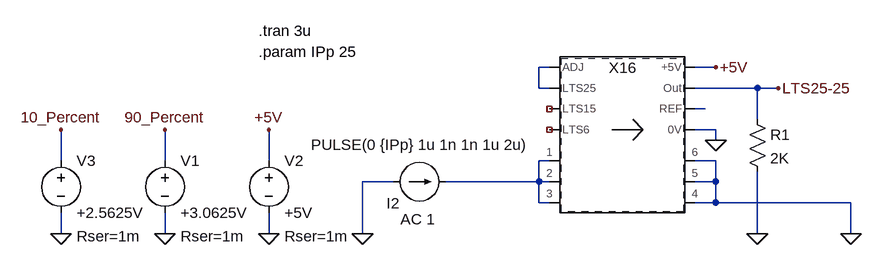
[diagram p0: schematic LTS-XX_hy_Test_Risetime.asc]
LTS-XX_hy_Test_Risetime.asc, the LTspice schematic file:
Version 4
SHEET 1 2536 1600
WIRE -384 336 -400 336
WIRE -128 336 -160 336
WIRE -400 368 -400 336
WIRE -384 368 -400 368
WIRE -64 368 -160 368
WIRE -32 368 -64 368
WIRE -144 400 -160 400
WIRE -64 416 -64 368
WIRE -128 432 -160 432
WIRE -128 448 -128 432
WIRE -1136 480 -1136 432
WIRE -976 480 -976 432
WIRE -816 480 -816 432
WIRE -384 480 -400 480
WIRE -128 480 -160 480
WIRE -624 512 -672 512
WIRE -400 512 -400 480
WIRE -400 512 -544 512
WIRE -384 512 -400 512
WIRE -128 512 -128 480
WIRE -128 512 -160 512
WIRE -400 544 -400 512
WIRE -384 544 -400 544
WIRE -128 544 -128 512
WIRE -128 544 -160 544
WIRE 80 544 -128 544
WIRE -1136 592 -1136 560
WIRE -976 592 -976 560
WIRE -816 592 -816 560
WIRE -672 592 -672 512
WIRE -64 592 -64 496
WIRE 80 592 80 544
FLAG -672 592 0
FLAG -128 448 0
FLAG -816 592 0
FLAG -816 432 +5V
FLAG -128 336 +5V
FLAG -32 368 LTS25-25
FLAG -64 592 0
FLAG 80 592 0
FLAG -976 592 0
FLAG -976 432 90_Percent
FLAG -1136 592 0
FLAG -1136 432 10_Percent
SYMBOL voltage -816 464 R0
WINDOW 123 0 0 Left 0
WINDOW 39 24 132 Left 0
SYMATTR SpiceLine Rser=1m
SYMATTR InstName V2
SYMATTR Value +5V
SYMBOL res -80 400 R0
SYMATTR InstName R1
SYMATTR Value 2K
SYMBOL current -624 512 M90
WINDOW 123 58 64 VLeft 0
WINDOW 39 0 0 Left 0
WINDOW 3 -57 209 VLeft 0
WINDOW 0 33 9 VLeft 0
SYMATTR Value2 AC 1
SYMATTR Value PULSE(0 {IPp} 1u 1n 1n 1u 2u)
SYMATTR InstName I2
SYMBOL LTS-XX_hy -272 448 R0
SYMATTR InstName X16
SYMBOL voltage -976 464 R0
WINDOW 123 0 0 Left 0
WINDOW 39 24 132 Left 0
SYMATTR SpiceLine Rser=1m
SYMATTR InstName V1
SYMATTR Value +3.0625V
SYMBOL voltage -1136 464 R0
WINDOW 123 0 0 Left 0
WINDOW 39 24 132 Left 0
SYMATTR SpiceLine Rser=1m
SYMATTR InstName V3
SYMATTR Value +2.5625V
TEXT -832 280 Left 0 !.tran 3u
TEXT -832 312 Left 0 !.param IPp 25

The netlist it stands for:
* LTS-XX_hy_Test_Risetime.asc
V2 +5V 0 +5V Rser=1m
R1 LTS25-25 0 2K
I2 0 N003 PULSE(0 {IPp} 1u 1n 1n 1u 2u) AC 1
XX16 +5V 0 LTS25-25 N003 N003 N003 0 0 0 N001 N001 NC_01 NC_02 N002 LTS-XX_hy  ; pins +5V 0V Out 1 2 3 4 5 6 ADJ LTS25 LTS15 LTS6 REF
V1 90_Percent 0 +3.0625V Rser=1m
V3 10_Percent 0 +2.5625V Rser=1m
.tran 3u
.param IPp 25
.backanno
.end